# Altium schematic sheet [5] Sensors.SchDoc
size B
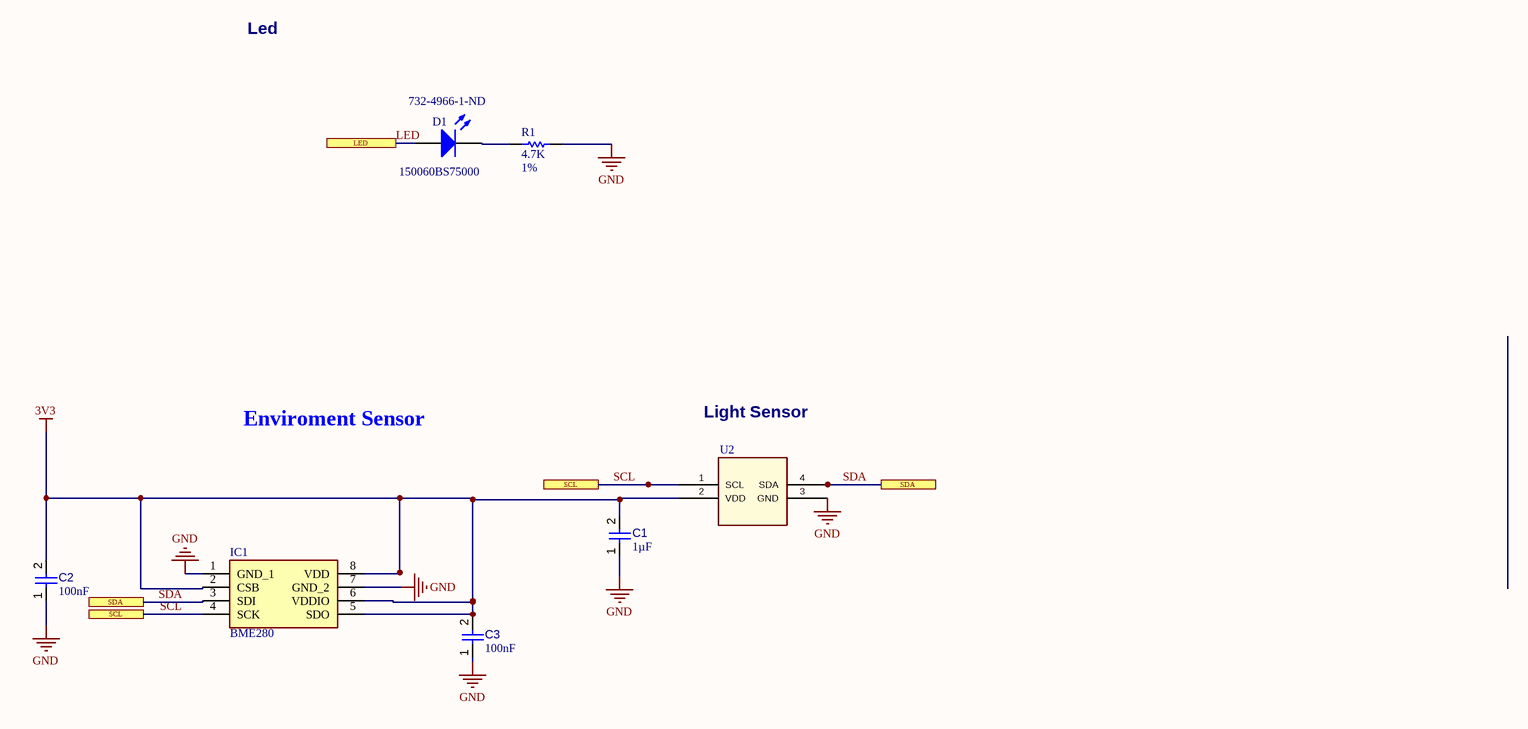
[diagram p0: [5] Sensors.SchDoc]

## Parts
C1  value 1µF  [CAPC1608X90X40ML10T20]  (hidden comment: Capacitor 1 uF +/- 10% 25 V 0603)
C2  value 100nF  [CAPC1608X90X40ML10T20]  (hidden comment: Capacitor 100 nF +/-10% 50 V 0603)
C3  value 100nF  [CAPC1608X90X40ML10T20]  (hidden comment: Capacitor 100 nF +/-10% 50 V 0603)
D1  Supplier Part Number 1: 732-4966-1-ND  PN: 150060BS75000  [LED BLUE CLEAR [0603]]  (hidden comment: LED)
IC1  BME280  [Sensor housing 8-pin LGA]
R1  Resistance: 4.7K  Tolerance: 1%  [RES 0603]  (hidden comment: RES 4.7K 1% 0.1W [0603])
U2  VEML7700-TR  [Ambient Light Sensor with I2C]  (value not drawn)

## Ports
LED, SCL, SDA

## Nets
3V3: C1.2 C2.2 C3.2 IC1.2(CSB) IC1.5(SDO) IC1.6(VDDIO) IC1.8(VDD) U2.2(VDD)
GND: C1.1 C2.1 C3.1 IC1.1(GND_1) IC1.7(GND_2) R1.2 U2.3(GND)
LED: D1.2 ; port LED
SCL: IC1.4(SCK) U2.1(SCL) ; port SCL
SDA: IC1.3(SDI) U2.4(SDA) ; port SDA
NetD1_1: D1.1 R1.1

## Notes on the sheet
- Led
- Enviroment Sensor
- Light Sensor

## Library data of the parts
C1 = CMP-001-00005-4: Chip Capacitor, 1 uF, +/- 10%, 25 V, 0603 (1608 Metric); Voltage Rating: 25V; Capacitor Type: Ceramic; Min Operating Temperature: -55°C; Tolerance: 10%; Max Operating Temperature: 125°C; Case/Package: 0603; RoHS Compliant: True; Mounting Technology: SM; Pins: 2
C2 C3 = CMP-001-00017-4: Chip Capacitor, 100 nF, +/- 10%, 50 V, 0603 (1608 Metric); Capacitor Type: Ceramic; Voltage Rating: 50V; RoHS Compliant: True; Max Operating Temperature: 125°C; Pins: 2; Mounting Technology: SM; Min Operating Temperature: -55°C; Tolerance: 10%; Case/Package: 0603
D1 = LED BLUE CLEAR 0603 SMD: Supplier 1: Digi-Key; Datasheet: https://katalog.we-online.de/led/datasheet/150060BS75000.pdf
IC1 = BME680: Integrated Circuit; Manufacturer_Name: Bosch Sensortec; Datasheet Link: https://ae-bst.resource.bosch.com/media/_tech/media/datasheets/BST-BME680-DS001-00.pdf; Manufacturer_Part_Number: BME680; Mouser Part Number: 262-BME680; Mouser Price/Stock: https://www.mouser.co.uk/ProductDetail/Bosch-Sensortec/BME680?qs=v271MhAjFHjo0yA%2FC4OnDQ%3D%3D; Arrow Part Number: BME680; Arrow Price/Stock: https://www.arrow.com/en/products/bme680/bosch
R1 = RES 4.7K 1% [0603]: PN: ERJ-3EKF4701V; Supplier 1: Digi-Key; Supplier Part Number 1: P4.70KHCT-ND
U2 = Ambient Light Sensor I2C: Ambient Light Sensor with I2C; Supplier 1: Digi-Key; Supplier Part Number 1: VEML7700CT-ND; Datasheet: https://media.digikey.com/pdf/Data%20Sheets/Vishay%20Semiconductors/VEML7700.pdf; PN: VEML7700-TR